# EAGLE design lpc111x (EAGLE 5.11)
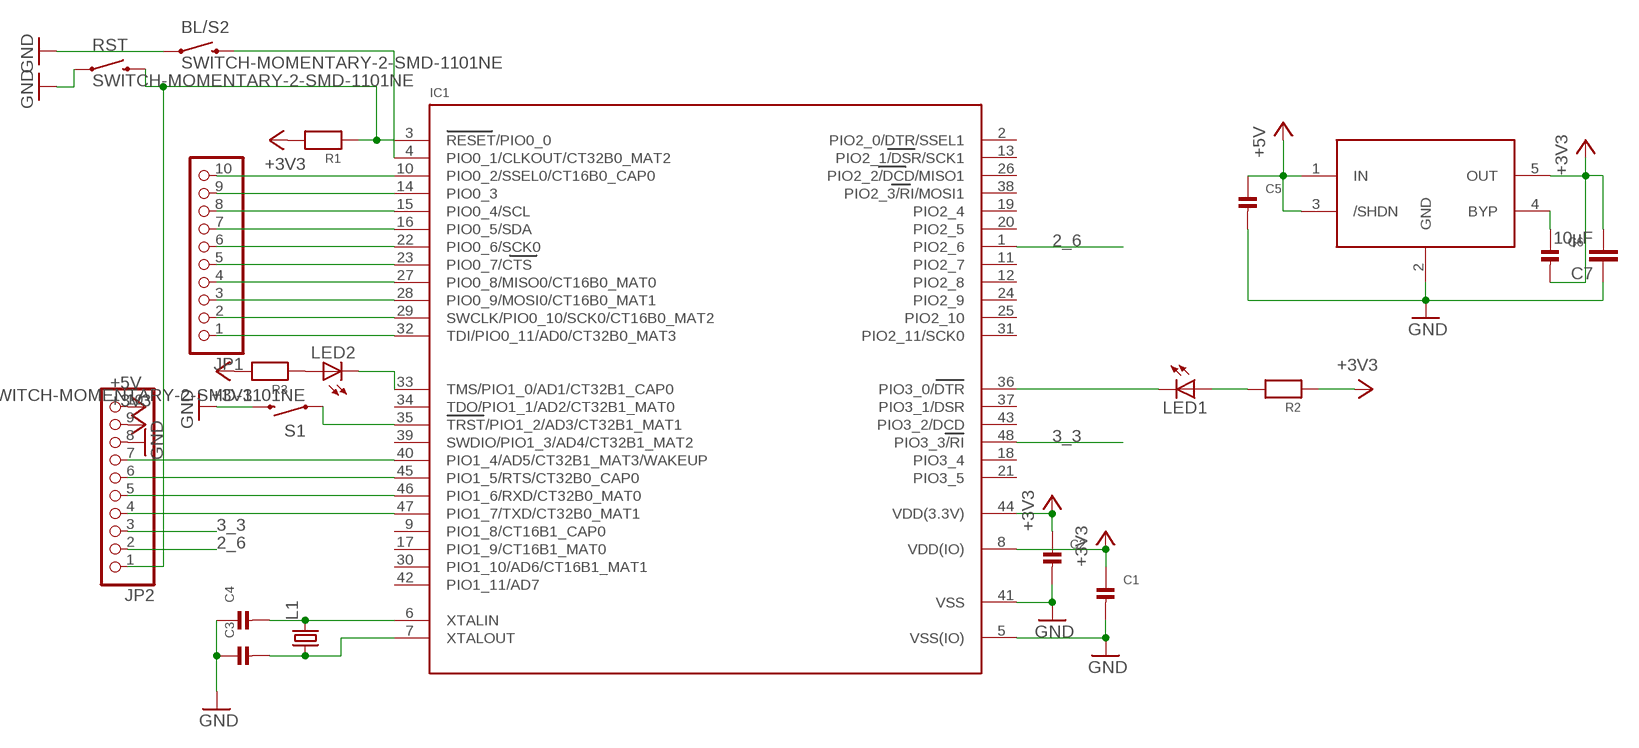
[diagram p0: schematic, sheet 1]

## Parts
BL/S2  SWITCH-MOMENTARY-2-SMD-1101NE  [TACTILE-SWITCH-1101NE]
C1  CAP_CERAMIC0603MINI  [0603-MINI]
C2  CAP_CERAMIC0603MINI  [0603-MINI]
C3  CAP_CERAMIC0603MINI  [0603-MINI]
C4  CAP_CERAMIC0603MINI  [0603-MINI]
C5  CAP_CERAMIC0603MINI  [0603-MINI]
C6  CAP_CERAMIC0603MINI  [0603-MINI]
C7  10µF  CAP0805  [0805]
IC1  LPC1113/4  [LQFP48]
IC2  LT1761  [SOT23-5L]
JP1  PINHD-1X10_2.54  [1X10]
JP2  PINHD-1X10_2.54  [1X10]
L1  X22-OSCILLATOR  [X22]
LED1  LEDCHIPLED_0805  [CHIPLED_0805]
LED2  LEDCHIPLED_0805  [CHIPLED_0805]
R1  RESISTOR0402  [0402]
R2  RESISTOR0402  [0402]
R3  RESISTOR0402  [0402]
RST  SWITCH-MOMENTARY-2-SMD-1101NE  [TACTILE-SWITCH-1101NE]
S1  SWITCH-MOMENTARY-2-SMD-1101NE  [TACTILE-SWITCH-1101NE]

## Nets
2_6: IC1.1(PIO2_6) JP2.2
3_3: IC1.48(PIO3_3/RI) JP2.3
+3V3: C1.1 C2.1 C6.2 C7.2 IC1.8(VDD(IO)) IC1.44(VDD(3.3V)) IC2.5(OUT) JP2.9 R1.2 R2.1 R3.2
+5V: C5.1 IC2.1(IN) IC2.3(/SHDN) JP2.10
GND: BL/S2.P$1 C1.2 C2.2 C3.1 C4.1 C5.2 C7.1 IC1.5(VSS(IO)) IC1.41(VSS) IC2.2(GND) JP2.8 RST.P$1 S1.P$2
N$1: IC1.32(TDI/PIO0_11/AD0/CT32B0_MAT3) JP1.1
N$2: IC1.29(SWCLK/PIO0_10/SCK0/CT16B0_MAT2) JP1.2
N$3: C3.2 IC1.7(XTALOUT) L1.1
N$4: C4.2 IC1.6(XTALIN) L1.3
N$5: IC1.28(PIO0_9/MOSI0/CT16B0_MAT1) JP1.3
N$6: IC1.27(PIO0_8/MISO0/CT16B0_MAT0) JP1.4
N$7: IC1.3(RESET/PIO0_0) JP2.1 R1.1 RST.P$2
N$8: IC1.23(PIO0_7/CTS) JP1.5
N$9: IC1.22(PIO0_6/SCK0) JP1.6
N$12: IC1.14(PIO0_3) JP1.9
N$13: IC1.10(PIO0_2/SSEL0/CT16B0_CAP0) JP1.10
N$16: IC1.45(PIO1_5/RTS/CT32B0_CAP0) JP2.6
N$17: IC1.40(PIO1_4/AD5/CT32B1_MAT3/WAKEUP) JP2.7
N$18: LED1.A R2.2
N$19: IC1.36(PIO3_0/DTR) LED1.C
N$20: IC1.35(TRST/PIO1_2/AD3/CT32B1_MAT1) S1.P$1
N$21: BL/S2.P$2 IC1.4(PIO0_1/CLKOUT/CT32B0_MAT2)
N$22: LED2.A R3.1
N$23: IC1.33(TMS/PIO1_0/AD1/CT32B1_CAP0) LED2.C
N$43: C6.1 IC2.4(BYP)
RX: IC1.46(PIO1_6/RXD/CT32B0_MAT0) JP2.5
SCL: IC1.15(PIO0_4/SCL) JP1.8
SDA: IC1.16(PIO0_5/SDA) JP1.7
TX: IC1.47(PIO1_7/TXD/CT32B0_MAT1) JP2.4
Unconnected: IC1.2(PIO2_0/DTR/SSEL1) IC1.9(PIO1_8/CT16B1_CAP0) IC1.11(PIO2_7) IC1.12(PIO2_8) IC1.13(PIO2_1/DSR/SCK1) IC1.17(PIO1_9/CT16B1_MAT0) IC1.18(PIO3_4) IC1.19(PIO2_4) IC1.20(PIO2_5) IC1.21(PIO3_5) IC1.24(PIO2_9) IC1.25(PIO2_10) IC1.26(PIO2_2/DCD/MISO1) IC1.30(PIO1_10/AD6/CT16B1_MAT1) IC1.31(PIO2_11/SCK0) IC1.34(TDO/PIO1_1/AD2/CT32B1_MAT0) IC1.37(PIO3_1/DSR) IC1.38(PIO2_3/RI/MOSI1) IC1.39(SWDIO/PIO1_3/AD4/CT32B1_MAT2) IC1.42(PIO1_11/AD7) IC1.43(PIO3_2/DCD)

## Library data of the parts
BL/S2 RST S1 = SparkFun:SWITCH-MOMENTARY-2
C1-C6 = microbuilder:CAP_CERAMIC: Ceramic Capacitors 0402 - 0402 Surface Mount Capacitors 16pF 50V 5% [Digikey: 445-4899-2-ND] 18pF 50V 5% [Digikey: 490-1281-2-ND] 22pF 50V 5% [Digikey: 490-1283-2-ND] 68pF 50V 5% [Digikey: 490-1289-2-ND] 0.1uF 10V 10% [Digikey: 490-1318-2-ND] 1.0uF 6.3V 10% [Digikey: 490-1320-2-ND] 0603 - 0603 Surface Mount Capacitors 16 pF 50V 5% [Digikey: 445-5051-2-ND] 22 pF 50V [Digikey: PCC220ACVTR-ND] 33 pF 50V 5% [Digikey: 490-1415-1-ND] 56pF 50V 5% [Digikey: 490-1421-1-ND] 220pF 50V 5% [Digikey: 445-1285-1-ND] 680 pF 50V 2200 pF 50V 5% C0G [Digikey: 445-1297-1-ND] 5600 pF 100V 5% X7R [Digikey: 478-3711-1-ND] 0.1 µF 25V 10% [Digikey: PCC2277TR-ND] 0.22 µF 16V 10% X7R [Digikey: 445-1318-1-ND] 1.0 µF 25V 10% [Digikey: 445-5146-2-ND] 0603 - RF Specific 3pF 250V +/-0.1pF RF [Digikey: 712-1347-1-ND] 18 pF 250V 5% [Digikey: 478-3505-1-ND or 712-1322-1-ND] 56 pF 250V 5% C0G RF [Digikey: 490-4867-1-ND] 68 pF 250V RF [Digikey: 490-4868-1-ND] 0805 - 0805 Surface Mount Capacitors 220 pF 250V 2% RF Ceramic Capacitor [Digikey: 712-1398-1-ND] 1000 pF 50V 2% NP0 Ceramic Capacitor [Digikey: 478-3760-1-ND] 0.1 µF 25V 10% Ceramic Capacitor [Digikey: PCC1828TR-ND] 1.0 µF 16V 10% Ceramic Capacitor[Digikey: 490-1691-2-ND] 10.0 µF 10V 10% Ceramic Capacitor[Digikey: 709-1228-1-ND] 10.0 uF 16V 10% Ceramic Capacitor [Digikey: 478-5165-2-ND] 47 uF 6.3V 20% Ceramic Capacitor [Digikey: 587-1779-1-ND or 399-5506-1-ND] 1206 - 1206 Surface Mount Capacitors 47uF 10V 20% Ceramic Capacitor [Digikey: 490-5528-1-ND or 399-5508-1-ND or 445-6010-1-ND]
C7 = SparkFun:CAP: Capacitor Standard 0603 ceramic capacitor, and 0.1" leaded capacitor.
IC1 = microbuilder:LPC1113/4: LPC1113/4 MCU QFP48 Package ARM Cortex M0, 50MHz Operation, 8 Channel 10-Bit ADC, 1²C, 2xSPI, UART, 2x16 Bit and 2x32 Bit Timers, Internal 12MHz Oscillator, 1.8-3.6V operation. Model Flash SRAM Part N°: Digikey Mouser LPC1113 24KB 8KB LPC1113FBD48/301 TBD TBD LPC1114 32KB 8KB LPC1114FBD48/301 568-4950-ND 771-LPC1114FBD483011; DIGIKEY#: 568-4950-ND; MANF: NXP; MANF#: LPC1114FBD48/301,1
IC2 = seb:LT1761
JP1 JP2 = pinhead-2:PINHD-1X10: PIN HEADER
L1 = seb:X22-OSCILLATOR
LED1 LED2 = led:LED: LED OSRAM: - CHIPLED LG R971, LG N971, LY N971, LG Q971, LY Q971, LO R971, LY R971 LH N974, LH R974 LS Q976, LO Q976, LY Q976 LO Q996 - Hyper CHIPLED LW Q18S LB Q993, LB Q99A, LB R99A - SideLED LS A670, LO A670, LY A670, LG A670, LP A670 LB A673, LV A673, LT A673, LW A673 LH A674 LY A675 LS A676, LA A676, LO A676, LY A676, LW A676 LS A679, LY A679, LG A679 - Hyper Micro SIDELED® LS Y876, LA Y876, LO Y876, LY Y876 LT Y87S - SmartLED LW L88C, LW L88S LB L89C, LB L89S, LG L890 LS L89K, LO L89K, LY L89K LS L896, LA L896, LO L896, LY L896 - TOPLED LS T670, LO T670, LY T670, LG T670, LP T670 LSG T670, LSP T670, LSY T670, LOP T670, LYG T670 LG T671, LOG T671, LSG T671 LB T673, LV T673, LT T673, LW T673 LH T674 LS T676, LA T676, LO T676, LY T676, LB T676, LH T676, LSB T676, LW T676 LB T67C, LV T67C, LT T67C, LS T67K, LO T67K, LY T67K, LW E67C LS E67B, LA E67B, LO E67B, LY E67B, LB E67C, LV E67C, LT E67C LW T67C LS T679, LY T679, LG T679 LS T770, LO T770, LY T770, LG T770, LP T770 LB T773, LV T773, LT T773, LW T773 LH T774 LS E675, LA E675, LY E675, LS T675 LS T776, LA T776, LO T776, LY T776, LB T776 LHGB T686 LT T68C, LB T68C - Hyper Mini TOPLED® LB M676 - Mini TOPLED Santana® LG M470 LS M47K, LO M47K, LY M47K Source: http://www.osram.convergy.de LUXEON: - LUMILED® LXK2-PW12-R00, LXK2-PW12-S00, LXK2-PW14-U00, LXK2-PW14-V00 LXK2-PM12-R00, LXK2-PM12-S00, LXK2-PM14-U00 LXK2-PE12-Q00, LXK2-PE12-R00, LXK2-PE12-S00, LXK2-PE14-T00, LXK2-PE14-U00 LXK2-PB12-K00, LXK2-PB12-L00, LXK2-PB12-M00, LXK2-PB14-N00, LXK2-PB14-P00, LXK2-PB14-Q00 LXK2-PR12-L00, LXK2-PR12-M00, LXK2-PR14-Q00, LXK2-PR14-R00 LXK2-PD12-Q00, LXK2-PD12-R00, LXK2-PD12-S00 LXK2-PH12-R00, LXK2-PH12-S00 LXK2-PL12-P00, LXK2-PL12-Q00, LXK2-PL12-R00 Source: www.luxeon.com KINGBRIGHT: KA-3528ASYC Source: www.kingbright.com
R1-R3 = microbuilder:RESISTOR: Resistors 0402 - 0402 Surface Mount Package 22 Ohm 1% 1/16W [Digikey: 311-22.0LRTR-ND] 33 Ohm 5% 1/16W 1.0K 5% 1/16W 1.5K 5% 1/16W 2.0K 1% 1/16W 10.0K 1% 1/16W [Digikey: 311-10.0KLRTR-ND] 10.0K 5% 1/16W [Digikey: RMCF0402JT10K0TR-ND] 12.1K 1% 1/16W [Digikey: 311-22.0LRTR-ND] 100.0K 5% 1/16W 0603 - 0603 Surface Mount Package 0 Ohm 1/10 Watt 1% Resistor 15 Ohm 1/10 Watt 1% Resistor 33 Ohm 1/10 Watt 1% Resistor 49.9 Ohm 1/10 Watt 1% Resistor 100 Ohm 1/10 Watt 1% Resistor 150 Ohm 1/10 Watt 1% Resistor 240 Ohm 1/10 Watt 1% Resistor 390 Ohm 1/10 Watt 1% Resistor 560 Ohm 1/10 Watt 1% Resistor 680 Ohm 1/10 Watt 1% Resistor 750 Ohm 1/10 Watt 1% Resistor 1.0K Ohm 1/10 Watt 1% Resistor 1.5K Ohm 1/10 Watt 1% Resistor 2.0K Ohm 1/10 Watt 1% Resistor 2.2K Ohm 1/10 Watt 1% Resistor 3.3K Ohm 1/10 Watt 1% Resistor 4.7K Ohm 1/10 Watt 1% Resistor 10.0K Ohm 1/10 Watt 1% Resistor 12.0K Ohm 1/10 Watt 1% Resistor 12.1K Ohm 1/10 Watt 1% Resistor 20.0K Ohm 1/10 Watt 1% Resistor 33.0K Ohm 1/10 Watt 1% Resistor 100.0K Ohm 1/10 Watt 1% Resistor 0805 - 0805 Surface Mount Package 0 Ohm 1/8 Watt 1% Resistor 33 Ohm 1/8 Watt 1% Resistor 100 Ohm 1/8 Watt 1% Resistor 150 Ohm 1/8 Watt 1% Resistor 200 Ohm 1/8 Watt 1% Resistor 240 Ohm 1/8 Watt 1% Resistor 330 Ohm 1/8 Watt 1% Resistor 390 Ohm 1/8 Watt 1% Resistor 470 Ohm 1/8 Watt 1% Resistor 1.0K Ohm 1/8 Watt 1% Resistor 1.5K Ohm 1/8 Watt 1% Resistor 2.0K Ohm 1/8 Watt 1% Resistor 4.7K Ohm 1/8 Watt 1% Resistor 5.1K Ohm 1/8 Watt 1% Resistor 5.6K Ohm 1/8 Watt 1% Resistor 10.0K Ohm 1/8 Watt 1% Resistor 22.0K Ohm 1/8 Watt 1% Resistor 33.0K Ohm 1/8 Watt 1% Resistor 100K Ohm 1/8 Watt 1% Resistor 1206 - 1206 Surface Mount Package 2012 - 2010 Surface Mount Package 0.11 Ohm 1/2 Watt 1% Resistor - Digikey: RHM.11UCT-ND

## Board
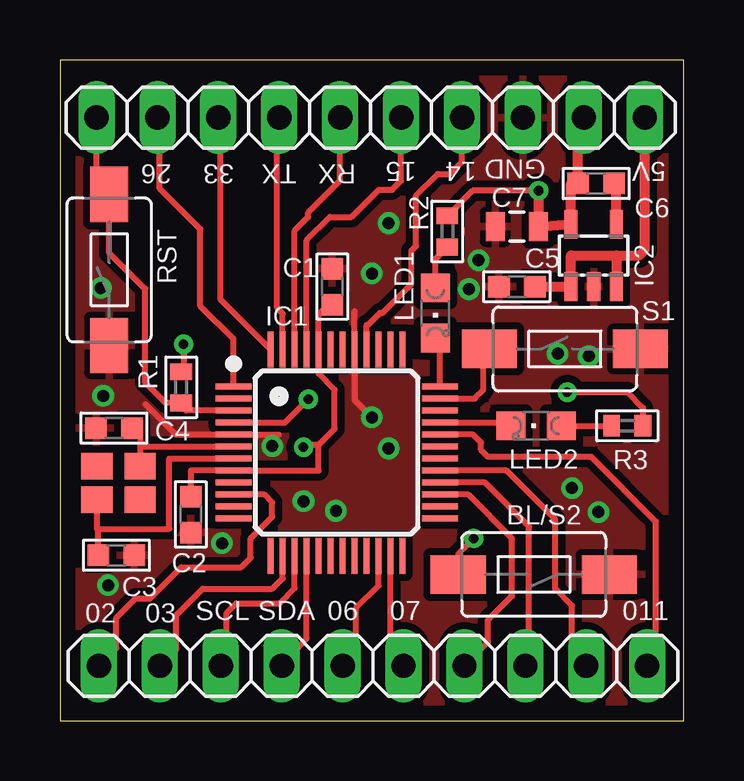
[diagram p1: board, top side]
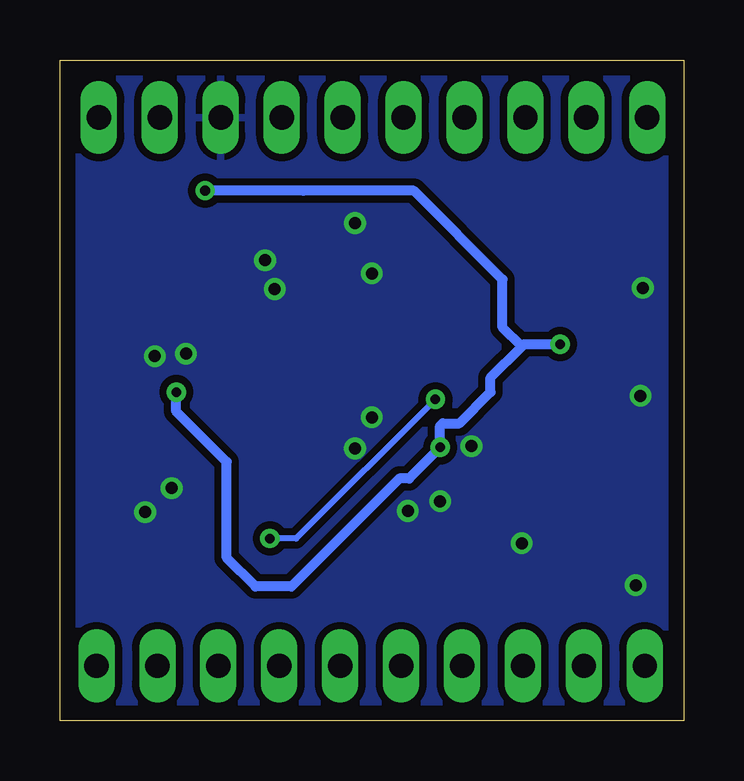
[diagram p2: board, bottom side, seen from below]

Size 26 x 27.55 mm. Coordinates in mm from the lower left corner, seen from the top.
Outline: 0,0 26,0 26,27.55 0,27.55 0,0
Copper layers (1*16): Top 0.035mm / dielectric 1.5mm / Bottom 0.035mm
Design rules "default *": minimum track width 10mil, minimum drill 24mil, track to track 8mil, track to pad 8mil, pad to pad 8mil, via to via 8mil, smd to smd 8mil, copper to edge 25mil, drill to drill 8mil, minimum pad ring 10mil, minimum via ring 8mil, stop-mask expansion 4mil, vias tented up to drill 40mil, thermal gap 10mil

### Footprints (pad centres in the part's own frame; a part is rotated, then mirrored left to right if it is on the bottom)
TACTILE-SWITCH-1101NE = smd 2.3 x 1.6: P$1 -3.15,0; P$2 3.15,0
0603-MINI = smd 0.9 x 0.9: 1 -0.75,0; 2 0.75,0
0805 = smd 0.8 x 1.2: 1 -0.9,0; 2 0.9,0
LQFP48 = smd 1.5 x 0.25: 1 -4.3,2.75; 2 -4.3,2.25; 3 -4.3,1.75; 4 -4.3,1.25; 5 -4.3,0.75; 6 -4.3,0.25; 7 -4.3,-0.25; 8 -4.3,-0.75; 9 -4.3,-1.25; 10 -4.3,-1.75; 11 -4.3,-2.25; 12 -4.3,-2.75; 25 4.3,-2.75; 26 4.3,-2.25; 27 4.3,-1.75; 28 4.3,-1.25; 29 4.3,-0.75; 30 4.3,-0.25; 31 4.3,0.25; 32 4.3,0.75; 33 4.3,1.25; 34 4.3,1.75; 35 4.3,2.25; 36 4.3,2.75 | smd 0.25 x 1.5: 13 -2.75,-4.3; 14 -2.25,-4.3; 15 -1.75,-4.3; 16 -1.25,-4.3; 17 -0.75,-4.3; 18 -0.25,-4.3; 19 0.25,-4.3; 20 0.75,-4.3; 21 1.25,-4.3; 22 1.75,-4.3; 23 2.25,-4.3; 24 2.75,-4.3; 37 2.75,4.3; 38 2.25,4.3; 39 1.75,4.3; 40 1.25,4.3; 41 0.75,4.3; 42 0.25,4.3; 43 -0.25,4.3; 44 -0.75,4.3; 45 -1.25,4.3; 46 -1.75,4.3; 47 -2.25,4.3; 48 -2.75,4.3
SOT23-5L = smd 0.55 x 1.2: 1 -0.95,-1.3; 2 0,-1.3; 3 0.95,-1.3; 4 0.95,1.3; 5 -0.95,1.3
1X10 = drill 1.016 long: 1 -11.43,0; 2 -8.89,0; 3 -6.35,0; 4 -3.81,0; 5 -1.27,0; 6 1.27,0; 7 3.81,0; 8 6.35,0; 9 8.89,0; 10 11.43,0
X22 = smd 1.3 x 1.1: 1 0.9,0.7; 2 -0.9,0.7; 3 -0.9,-0.7; 4 0.9,-0.7
CHIPLED_0805 = smd 1.2 x 1.2: A 0,-1.05; C 0,1.05
0402 = smd 0.7 x 0.9: 1 -0.65,0; 2 0.65,0

### Placement (x,y rotation side)
BL/S2  19.75,6.1 180 top
C1  11.35,18.1 90 top
C2  5.45,8.6 270 top
C3  2.35,6.9 180 top
C4  2.25,12.2 0 top
C5  19.05,18.1 180 top
C6  22.35,22.4 180 top
C7  19.05,20.6 0 top
IC1  11.53,11.18 0 top
IC2  22.25,19.4 0 top
JP1  13.05,2.29 180 top
JP2  12.95,25.15 0 top
L1  2.44,9.91 180 top
LED1  15.65,17 180 top
LED2  19.85,12.3 90 top
R1  5.05,13.9 90 top
R2  16.15,20.4 270 top
R3  23.65,12.3 0 top
RST  2.05,18.8 90 top
S1  21.05,15.5 0 top

### Tracks (layer width: path | path; a pad name or v marks a point on that pad's centre or on a via)
2_6
  Top 0.254: IC1.1 7.23,15.92 5.85,17.3 5.85,20.5 4.16,22.19 4.16,25.05 JP2.2
3_3
  Top 0.254: IC1.48 6.7,17.56 6.7,25.05 JP2.3
+3V3  (via drill 0.4)
  Top 0.254: C2.1 5.45,10.43 IC1.8 10.78,10.43 10.78,11.5 | C1.1 11.2,17.35 10.78,16.93 IC1.44 10.78,14.47 11.45,13.8 11.45,12.17 10.78,11.5 | v10.15,11.4 10.25,11.5 10.78,11.5 | R1.2 5.15,14.55 v5.15,15.7 | R2.1 17.2,22.1 v19.95,22.1 | R3.2 24.3,13.05 23.65,13.7 v21.15,13.7
  Top 0.406: v19.95,22.1 C7.2 IC2.5 21.3,22.4 C6.2 21.6,24.91 JP2.9
  Bottom 0.406: v19.95,22.1 15.85,22.1 11.25,22.1 7.55,18.4 7.55,16.4 6.75,15.6 | 6.75,15.6 8.05,14.3 8.05,13.7 9.35,12.4 10.05,12.4 10.15,12.3 v10.15,11.4 11.45,10.1 11.85,10.1 16.35,5.6 17.85,5.6 19.05,6.8 19.05,10.8 21.15,12.9 v21.15,13.7 | 6.75,15.6 6.65,15.7 v5.15,15.7
+5V
  Top 0.406: C5.1 IC2.1 21.3,19.4 23.2,19.4 | 23.2,19.4 IC2.3 | JP2.10 24.38,19.63 24.15,19.4 23.2,19.4
GND  (via drill 0.5)
  Top 0.254: IC1.41 12.28,14.97 | 12.28,14.97 12.28,13.37 v13,12.65 | 3.55,13.2 4.82,11.93 IC1.5 9.13,11.93 | 12.28,14.97 12.28,17.08
  other vias: 10.15,9.15 2,5.65 6.75,7.4 22.45,8.7 21.35,9.7 22.05,15.2 20.75,15.3 17.45,19.2 17.05,18 1.7,18.05 1.8,13.55 13,18.65 13.7,20.75 8.85,11.45 13.7,11.35 11.5,8.75
  pour Top (isolate 0.305): 0,0.4 26,0.4 26,27.15 0,27.15
  pour Bottom (isolate 0.305): 0,0.4 26,0.4 26,27.15 0,27.15
N$1
  Top 0.254: JP1.1 24.85,3.26 24.85,8.3 22.15,11 17.85,11 17.55,11.3 17.55,11.6 17.22,11.93 IC1.32
N$2
  Top 0.254: IC1.29 18.62,10.43 20.65,8.4 20.65,5.5 21.35,4.8 21.35,2.99 JP1.2
N$3
  Top 0.254: IC1.7 4.55,10.93 4.55,8 1.6,8 | L1.1 1.54,8 1.6,8 | C3.2 1.6,8
N$4
  Top 0.254: 3.34,11.43 IC1.6 | 3.34,11.43 L1.3 | C4.2 3.34,12.5 3.34,11.43
N$5
  Top 0.254: IC1.28 17.72,9.93 19.55,8.1 19.55,2.25 JP1.3
N$6
  Top 0.254: IC1.27 17.02,9.43 18.85,7.6 18.85,5.2 17.85,4.2 17.85,3.28 JP1.4
N$7
  Top 0.254: IC1.3 5.27,12.93 R1.1 4.4,13.25 3.55,14.1 3.55,18 2.05,19.5 RST.P$2 1.52,21.88 JP2.1
N$8
  Top 0.254: IC1.23 13.78,2.94 JP1.5
N$9
  Top 0.254: IC1.22 13.28,5.63 12.35,4.7 12.35,2.97 JP1.6
N$12
  Top 0.254: IC1.14 9.28,5.93 8.85,5.5 5.95,5.5 4.85,4.4 4.85,2.98 JP1.9
N$13
  Top 0.254: IC1.10 8.52,9.43 8.85,9.1 8.85,8.5 7.95,7.6 7.95,6.8 7.55,6.4 5.05,6.4 3.75,5.1 3.15,5.1 2.35,4.3 2.35,3.02 JP1.10
N$16
  Top 0.254: IC1.45 10.28,20.03 11.25,21 12.15,21 13.29,22.14 13.85,22.14 14.22,22.51 JP2.6
N$17
  Top 0.254: IC1.40 12.78,16.5 12.85,16.5 13.35,17 13.45,17 14.65,18.2 14.65,19.6 14.85,19.8 14.85,21.9 15.75,22.8 16.25,22.8 16.76,23.31 JP2.7
N$18
  Top 0.254: R2.2 15.65,19.25 LED1.A
N$19
  Top 0.254: LED1.C 15.83,15.63 IC1.36
N$20
  Top 0.254: IC1.35 17.28,13.43 17.65,13.8 17.65,14.85 S1.P$1
N$21  (via drill 0.4)
  Top 0.254: BL/S2.P$2 16.6,6.95 v17.25,7.6 | IC1.4 8.78,12.43 9.38,12.43 v10.35,13.4
  Bottom 0.254: v17.25,7.6 16.15,7.6 v10.35,13.4
N$22
  Top 0.254: LED2.A R3.1
N$23
  Top 0.254: IC1.33 18.67,12.43 LED2.C
N$43
  Top 0.406: C6.1 23.2,22.4 IC2.4
RX
  Top 0.254: IC1.46 9.78,20.43 10.35,21 10.35,21.18 11.68,22.51 JP2.5
SCL
  Top 0.254: IC1.15 9.78,5.53 9.15,4.9 7.35,4.9 6.95,4.5 6.95,2.65 JP1.8
SDA
  Top 0.254: IC1.16 10.28,3.44 JP1.7
TX
  Top 0.254: IC1.47 9.28,16.97 9.05,17.2 9.05,25.06 JP2.4

### Text on the board
tNames: 26 | 33 | TX | RX | 15 | 14 | GND | 5V | 02 | 03 | SCL | SDA | 06 | 07 | 011